# Altium schematic sheet ArduinoZeroV4.0_2.SchDoc: ArduinoZeroV4.0
size 409 x 289 mm; Origin: Eagle; Date: 2023-03-06 22:00:55; SheetNumber: 3; CODE-ARDUINO: DNP; DATASHEET: DNP; DISTRIBUTOR-LINK: DNP; DISTRIBUTOR-PN: DNP; MANUFACTURER: DNP; MANUFACTURER-PN: DNP; NOTE: DNP; Value: DNP; GateName_1: G$1; SymbolName_1: A3L-LOC; LibraryName: Arduino-utility; DeviceSetName: A3-FRAME; Sheet: Sheet:; ReferenceDesignsAREPROVIDED"ASIS"AND"WITHALLFAULTS.ArduinoSADISCLAIMSALLOTHERWARRANTIES,EXPRESSORIMPLIED,
REGARDINGPRODUCTS,INCLUDINGBUTNOTLIMITEDTO,ANYIMPLIEDWARRANTIESOFMERCHANTABILITYORFITNESSFORAPARTICULARPURPOSE

ArduinoSAmaymakechangestospecificationsandproductdescriptionsatanytime,withoutnotice.TheCustomermustnot
relyontheabsenceorcharacteristicsofanyfeaturesorinstructionsmarked"reserved"or"undefined."ArduinoSAreserves
theseforfuturedefinitionandshallhavenoresponsibilitywhatsoeverforconflictsorincompatibilitiesarisingfromfuturechangestothem.
TheproductinformationontheWebSiteorMaterialsissubjecttochangewithoutnotice.Donotfinalizeadesignwiththisinfo

ARDUINOandotherArduinobrandsandlogosandTrademarksofArduinoSA.AllArduinoSATrademarkscannotbeusedwithoutowner'sformalpermission: Reference Designs ARE PROVIDED "AS IS" AND "WITH ALL FAULTS. Arduino SA DISCLAIMS ALL OTHER WARRANTIES, EXPRESS OR IMPLIED, / REGARDING PRODUCTS, INCLUDING BUT NOT LIMITED TO, ANY IMPLIED WARRANTIES OF MERCHANTABILITY OR FITNESS FOR A PARTICULAR PURPOSE / Arduino SA may make changes to specifications and product descriptions at any time, without notice. The Customer must not / rely on the absence or characteristics of any features or instructions marked "reserved" or "undefined." Arduino SA reserves / these for future definition and shall have no responsibility whatsoever for conflicts or incompatibilities arising from future changes to them. / The product information on the Web Site or Materials is subject to change without notice. Do not finalize a design with this info / ARDUINO and other Arduino brands and logos and Trademarks of Arduino SA. All Arduino SA Trademarks cannot be used without owner's formal permission
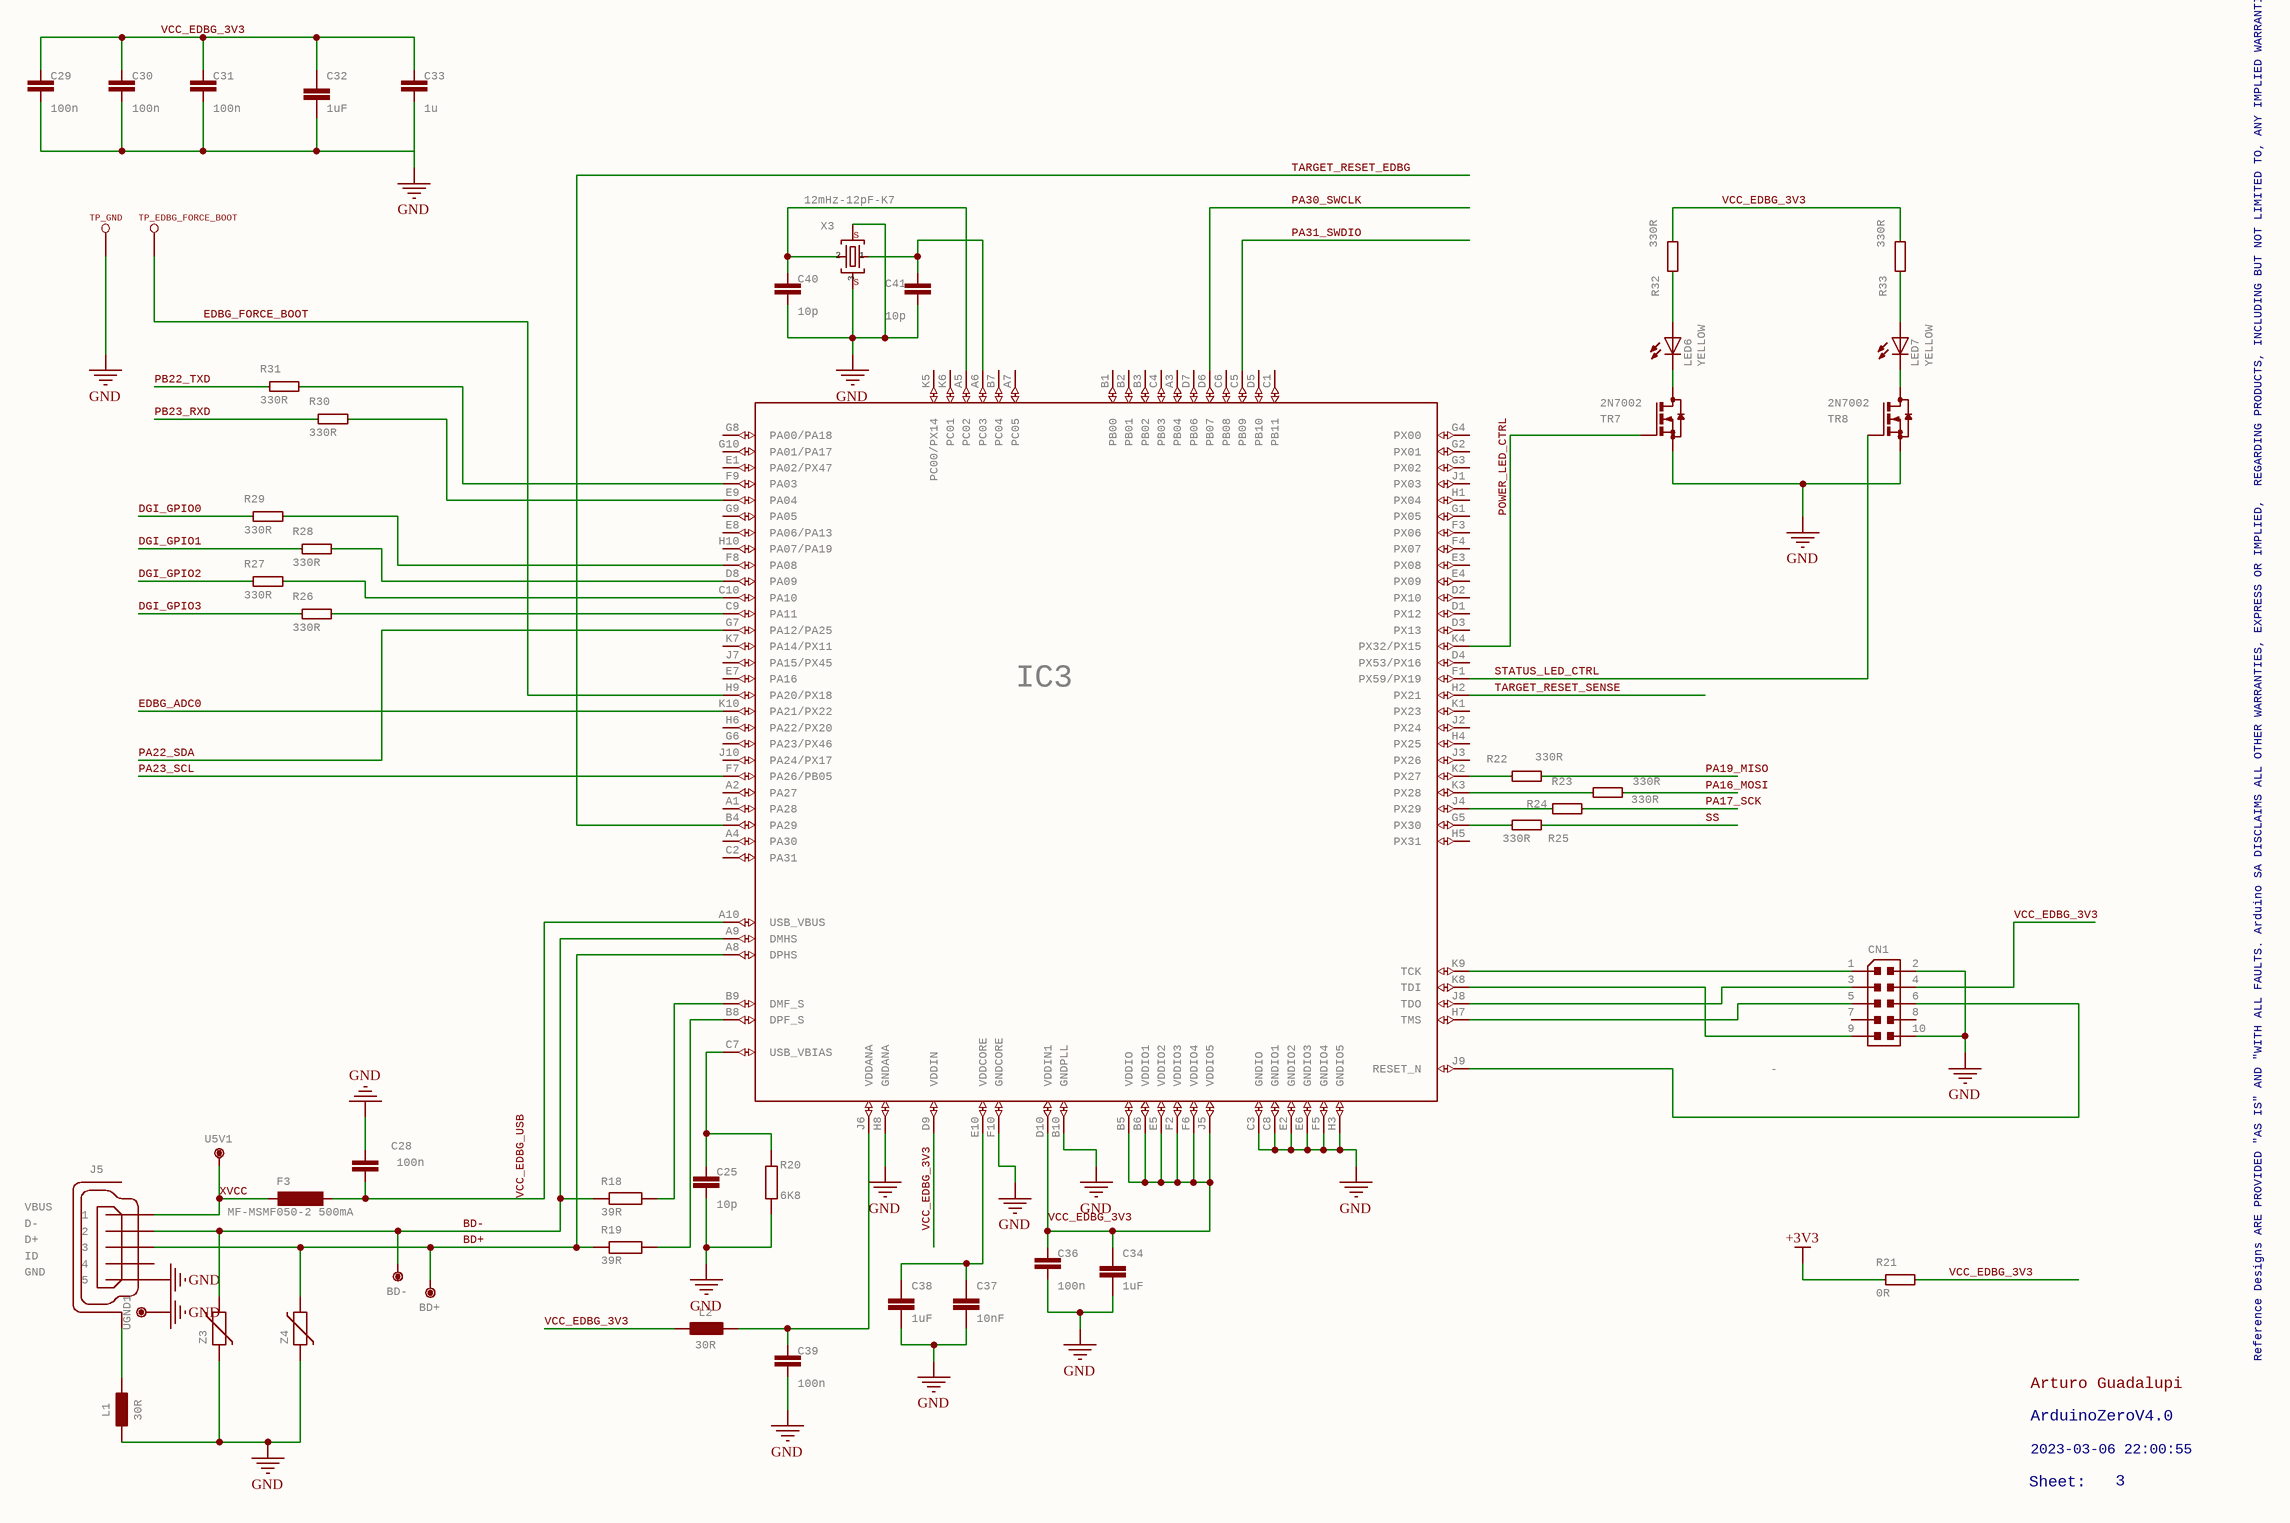
[diagram p0: ArduinoZeroV4.0_2.SchDoc]

## Parts
BD+  DNP  [TP-1.00MM]  (value not drawn)
BD-  DNP  [TP-1.00MM]  (value not drawn)
C25  10p  [0603-1608X90N]
C28  100n  [0603-1608X90N]
C29  100n  [0603-1608X90N]
C30  100n  [0603-1608X90N]
C31  100n  [0603-1608X90N]
C32  1uF  [C0603-ROUND]
C33  1u  [0603-1608X90N]
C34  1uF  [C0603-ROUND]
C36  100n  [0603-1608X90N]
C37  10nF  [C0603-ROUND]
C38  1uF  [C0603-ROUND]
C39  100n  [0603-1608X90N]
C40  10p  [0603-1608X90N]
C41  10p  [0603-1608X90N]
CN1  -  [PINHEAD_2X05_127]
F3  MF-MSMF050-2 500mA  [L1812]
IC3  1791_AT32UC3A4256HHB-C1UR  [VFBGA100]  (value not drawn)
J5  -  [ZX62-AB-5PA]  (value not drawn)
L1  30R  [0805-R2013X50N]
L2  30R  [0805-R2013X50N]
LED6  YELLOW  [CHIPLED_0805]
LED7  YELLOW  [CHIPLED_0805]
R18  39R  [R0603-ROUND]
R19  39R  [R0603-ROUND]
R20  6K8  [R0603-ROUND]
R21  0R  [C0603]
R22  330R  [C0603]
R23  330R  [C0603]
R24  330R  [C0603]
R25  330R  [C0603]
R26  330R  [C0603]
R27  330R  [C0603]
R28  330R  [C0603]
R29  330R  [C0603]
R30  330R  [C0603]
R31  330R  [C0603]
R32  330R  [C0603]
R33  330R  [C0603]
TP_EDBG_FORCE_BOOT  TP_SP  [TP-SP]  (value not drawn)
TP_GND  TP_SP  [TP-SP]  (value not drawn)
TR7  2N7002  [SOT23]
TR8  2N7002  [SOT23]
U5V1  DNP  [TP-1.00MM]  (value not drawn)
UGND1  DNP  [TP-1.00MM]  (value not drawn)
X3  12mHz-12pF-K7  [CRYSTAL-3.2-2.5]
Z3  -  [C0603]  (value not drawn)
Z4  -  [C0603]  (value not drawn)

## Nets
+3V3: R21.1
GND: C25.2 C28.2 C29.2 C30.2 C31.2 C32.2 C33.2 C34.2 C36.2 C37.2 C38.2 C39.2 C40.2 C41.2 CN1.2 CN1.10 IC3.B10(GNDPLL) IC3.C3(GNDIO) IC3.C8(GNDIO1) IC3.E2(GNDIO2) IC3.E6(GNDIO3) IC3.F5(GNDIO4) IC3.F10(GNDCORE) IC3.H3(GNDIO5) IC3.H8(GNDANA) J5.5 L1.1 R20.1 TP_GND.X(TESTP) TR7.2(S) TR8.2(S) UGND1.X(P$1) X3.2(GND) X3.4(GND) Z3.1 Z4.1
BD+: BD+.X(P$1) IC3.A8(DPHS) J5.3 R19.1 Z4.2
BD-: BD-.X(P$1) IC3.A9(DMHS) J5.2 R18.1 Z3.2
DGI_GPIO0: R29.1
DGI_GPIO1: R28.1
DGI_GPIO2: R27.1
DGI_GPIO3: R26.1
EDBG_ADC0: IC3.K10(PA21/PX22)
EDBG_FORCE_BOOT: IC3.H9(PA20/PX18) TP_EDBG_FORCE_BOOT.X(TESTP)
PA16_MOSI: R23.2
PA17_SCK: R24.2
PA19_MISO: R22.2
PA22_SDA: IC3.G7(PA12/PA25)
PA23_SCL: IC3.F7(PA26/PB05)
PA30_SWCLK: IC3.D6(PB07)
PA31_SWDIO: IC3.C5(PB09)
PB22_TXD: R31.1
PB23_RXD: R30.1
POWER_LED_CTRL: IC3.K4(PX32/PX15) TR7.1(G)
SS: R25.2
STATUS_LED_CTRL: IC3.F1(PX59/PX19) TR8.1(G)
TARGET_RESET_EDBG: IC3.B4(PA29)
TARGET_RESET_SENSE: IC3.H2(PX21)
VCC_EDBG_3V3: C29.1 C30.1 C31.1 C32.1 C33.1 C34.1 C36.1 CN1.4 IC3.B5(VDDIO) IC3.B6(VDDIO1) IC3.D9(VDDIN) IC3.D10(VDDIN1) IC3.E5(VDDIO2) IC3.F2(VDDIO3) IC3.F6(VDDIO4) IC3.J5(VDDIO5) L2.1 R21.2 R32.2 R33.2
VCC_EDBG_USB: C28.1 F3.1 IC3.A10(USB_VBUS)
XVCC: F3.2 J5.1 U5V1.X(P$1)
NetC25_1: C25.1 IC3.C7(USB_VBIAS) R20.2
NetC37_1: C37.1 C38.1 IC3.E10(VDDCORE)
NetC39_1: C39.1 IC3.J6(VDDANA) L2.2
NetC40_1: C40.1 IC3.A5(PC02) X3.3(C2)
NetC41_1: C41.1 IC3.A6(PC03) X3.1(C1)
NetCN1_1: CN1.1 IC3.K9(TCK)
NetCN1_3: CN1.3 IC3.J8(TDO)
NetCN1_5: CN1.5 IC3.H7(TMS)
NetCN1_6: CN1.6 IC3.J9(RESET_N)
NetCN1_9: CN1.9 IC3.K8(TDI)
NetIC3_B8: IC3.B8(DPF_S) R19.2
NetIC3_B9: IC3.B9(DMF_S) R18.2
NetIC3_C9: IC3.C9(PA11) R26.2
NetIC3_C10: IC3.C10(PA10) R27.2
NetIC3_D8: IC3.D8(PA09) R28.2
NetIC3_E9: IC3.E9(PA04) R30.2
NetIC3_F8: IC3.F8(PA08) R29.2
NetIC3_F9: IC3.F9(PA03) R31.2
NetIC3_G5: IC3.G5(PX30) R25.1
NetIC3_J4: IC3.J4(PX29) R24.1
NetIC3_K2: IC3.K2(PX27) R22.1
NetIC3_K3: IC3.K3(PX28) R23.1
NetJ5_6-11: J5.6-11(SH) L1.2
NetLED6_A: LED6.A R32.1
NetLED6_C: LED6.C TR7.3(D)
NetLED7_A: LED7.A R33.1
NetLED7_C: LED7.C TR8.3(D)

Not connected (* = marked no-connect by the designer): CN1 7 8; IC3 A1(PA28) A2(PA27) A3(PB04) A4(PA30) A7(PC05) B1(PB00) B2(PB01) B3(PB02) B7(PC04) C1(PB11) C2(PA31) C4(PB03) C6(PB08) D1(PX12) D2(PX10) D3(PX13) D4(PX53/PX16) D5(PB10) D7(PB06) E1(PA02/PX47) E3(PX08) E4(PX09) E7(PA16) E8(PA06/PA13) F3(PX06) F4(PX07) G1(PX05) G2(PX01) G3(PX02) G4(PX00) G6(PA23/PX46) G8(PA00/PA18) G9(PA05) G10(PA01/PA17) H1(PX04) H4(PX25) H5(PX31) H6(PA22/PX20) H10(PA07/PA19) J1(PX03) J2(PX24) J3(PX26) J7(PA15/PX45) J10(PA24/PX17) K1(PX23) K5(PC00/PX14) K6(PC01) K7(PA14/PX11); J5 4

## Notes on the sheet
- Reference Designs ARE PROVIDED "AS IS" AND "WITH ALL FAULTS. Arduino SA DISCLAIMS ALL OTHER WARRANTIES, EXPRESS OR IMPLIED,
  REGARDING PRODUCTS, INCLUDING BUT NOT LIMITED TO, ANY IMPLIED WARRANTIES OF MERCHANTABILITY OR FITNESS FOR A PARTICULAR PURPOSE
  Arduino SA may make changes to specifications and product descriptions at any time, without notice. The Customer must not
  rely on the absence or characteristics of any features or instructions marked "reserved" or "undefined." Arduino SA reserves
  these for future definition and shall have no responsibility whatsoever for conflicts or incompatibilities arising from future changes to them.
  The product information on the Web Site or Materials is subject to change without notice. Do not finalize a design with this info
  ARDUINO and other Arduino brands and logos and Trademarks of Arduino SA. All Arduino SA Trademarks cannot be used without owner's formal permission
- Arturo Guadalupi
- ArduinoZeroV4.0
- Sheet:
- 2023-03-06 22:00:55
- 3

## Library data of the parts
BD+ BD- U5V1 UGND1 = TPTP-1.00MM: Testpoint; GateName_1: G$1; DeviceSetName: TP; SymbolName_1: TESTPOINT; DeviceName: TP-1.00MM; LibraryName: Arduino-utility; CODE-ARDUINO: DNP; DATASHEET: DNP; DISTRIBUTOR-LINK: DNP; DISTRIBUTOR-PN: DNP; MANUFACTURER: DNP; MANUFACTURER-PN: DNP
C25 C40 C41 = C-0603: SMD Capacitor; GateName_1: G$1; SymbolName_1: C; DeviceName: -0603; CODE-ARDUINO: A5144; LibraryName: Arduino-rcl; DeviceSetName: C; DATASHEET: -; DISTRIBUTOR-LINK: -; DISTRIBUTOR-PN: -; MANUFACTURER: -; MANUFACTURER-PN: -; NOTE: -; PN-ALTERNATIVE1: PN-ALTERNATIVE1; PN-ALTERNATIVE2: PN-ALTERNATIVE2; PN-ALTERNATIVE3: PN-ALTERNATIVE3; PN-ALTERNATIVE4: PN-ALTERNATIVE4; PN-ALTERNATIVE5: PN-ALTERNATIVE5
C28-C31 C36 C39 = C-0603: SMD Capacitor; MANUFACTURER: Murata; MANUFACTURER-PN: GRM188R71C104KA01D; GateName_1: G$1; SymbolName_1: C; DeviceName: -0603; CODE-ARDUINO: 0015; PN-ALTERNATIVE1: NMC0603Y5V104Z25TRPF; PN-ALTERNATIVE2: C1608F104Z500NT; PN-ALTERNATIVE3: C0603C104K3RAC7411; PN-ALTERNATIVE4: 06035D104KAT2A; PN-ALTERNATIVE5: 0603B104K500CT; LibraryName: Arduino-rcl; DeviceSetName: C; DATASHEET: http://search.murata.co.jp/Ceramy/image/img/A01X/G101/ENG/GRM188R71C104KA01-01.pdf; DISTRIBUTOR-LINK: https://www.digikey.com/product-detail/en/murata-electronics-north-america/GRM188R71C104KA01D/490-1532-1-ND/587771; DISTRIBUTOR-PN: 490-1532-2-ND; NOTE: -
C32 C34 C38 = 0006_1UF_0603/GRM188R61E105KA12D: 1uF 0603; GateName_1: G$1; SymbolName_1: C-EU; MONTHLY_USAGE: _____; TYPE: Condensatori; LibraryName: Condensatori; DeviceSetName: 0006_1UF_0603/GRM188R61E105KA12D; CASE: 0603; PART_NUMBER: 1uF_0603/GRM188R61E105KA12D; PRICE: _____; SUPPLIER: _____
C33 = C-0603: SMD Capacitor; MANUFACTURER: Samsung; MANUFACTURER-PN: CL10B105KP8NNNC; GateName_1: G$1; SymbolName_1: C; DeviceName: -0603; CODE-ARDUINO: 0006; PN-ALTERNATIVE1: 0603X105K250CT; LibraryName: Arduino-rcl; DeviceSetName: C; DATASHEET: http://www.samsungsem.com/kr/support/product-search/mlcc/__icsFiles/afieldfile/2016/08/18/S_CL10B105KP8NNNC.pdf; DISTRIBUTOR-LINK: https://www.digikey.com/product-detail/en/samsung-electro-mechanics-america-inc/CL10B105KP8NNNC/1276-1946-1-ND/3890032; DISTRIBUTOR-PN: 1276-1946-1-ND; NOTE: -; PN-ALTERNATIVE2: PN-ALTERNATIVE2; PN-ALTERNATIVE3: PN-ALTERNATIVE3; PN-ALTERNATIVE4: PN-ALTERNATIVE4; PN-ALTERNATIVE5: PN-ALTERNATIVE5
C37 = 0408_1NF_0603: 1nF 0603; GateName_1: G$1; SymbolName_1: C-EU; MONTHLY_USAGE: _____; TYPE: Condensatori; LibraryName: Condensatori; DeviceSetName: 0408_1NF_0603; CASE: 0603; PART_NUMBER: 1nF_0603; PRICE: _____; SUPPLIER: _____
CN1 = JTAG_CONNECTOR-ROUND: 2x5 PASSO 1,27; GateName_1: G$1; DeviceName: -ROUND; CODE-ARDUINO: 0171; SymbolName_1: PINHEAD_2X05_127; LibraryName: Arduino-connectors; DeviceSetName: JTAG_CONNECTOR; DATASHEET: -; DISTRIBUTOR-LINK: -; DISTRIBUTOR-PN: -; MANUFACTURER: -; MANUFACTURER-PN: -
F3 = 0002_MF-MSMF050-2: 500 mA Multifuse ï¿½ Polyfuse; GateName_1: G$1; SymbolName_1: L-EU; MONTHLY_USAGE: _____; TYPE: Protezione; LibraryName: Protezione; DeviceSetName: 0002_MF-MSMF050-2; CASE: CASE; PART_NUMBER: MF-MSMF050-2; PRICE: _____; SUPPLIER: _____
IC3 = 1791_AT32UC3A4256HHB-C1UR: ATMEL  32-bit AVR  Microcontroller - VFBGA100; GateName_1: G$1; SymbolName_1: AT32UC3A; LibraryName: IntegratedCircuits; DeviceSetName: 1791_AT32UC3A4256HHB-C1UR
J5 = USB-MICRO: USB - micro AB USB 2.0 Receptacle Connector 5 Position Surface Mount, Right Angle, Horizontal; MANUFACTURER: Hirose; MANUFACTURER-PN: ZX62-AB-5PA(31); GateName_1: G$1; CODE-ARDUINO: 2219; SymbolName_1: USB-MICRO; LibraryName: Arduino-connectors; DeviceSetName: USB-MICRO; VBUS: VBUS; D-: D-; D+: D+; ID: ID; GND: GND; DATASHEET: https://www.hirose.com/product/en/download_file/key_name/ZX/category/Catalog/doc_file_id/31704/?file_category_id=4&item_id=13&is_series=1; DISTRIBUTOR-LINK: http://www.digikey.com/product-detail/en/hirose-electric-co-ltd/ZX62-AB-5PA(31)/H125279CT-ND/5994741; DISTRIBUTOR-PN: H125279CT-ND
L1 L2 = FERRITE0805: SMD ferrite; MANUFACTURER: Murata; MANUFACTURER-PN: BLM21PG300SN1D; GateName_1: >NAME; DeviceName: 0805; CODE-ARDUINO: 0001; PN-ALTERNATIVE1: MH2029-300Y; SymbolName_1: FERRITE; LibraryName: Arduino-rcl; DeviceSetName: FERRITE; DATASHEET: https://www.murata.com/en-us/products/productdata/8796738977822/ENFA0005.pdf; DISTRIBUTOR-LINK: https://www.digikey.it/product-detail/en/murata-electronics-north-america/BLM21PG300SN1D/490-1052-1-ND/584499; DISTRIBUTOR-PN: 490-1052-1-ND
LED6 LED7 = LED-0805: LED; MANUFACTURER: Lite-On; MANUFACTURER-PN: LTST-C170YKT; GateName_1: G$1; DeviceName: -0805; CODE-ARDUINO: 0044; PN-ALTERNATIVE1: KPT-2012YC; SymbolName_1: LED; LibraryName: Arduino-diodes; DeviceSetName: LED; DATASHEET: https://media.digikey.com/pdf/Data%20Sheets/Lite-On%20PDFs/LTST-C170GKT.pdf; DISTRIBUTOR-LINK: https://www.digikey.com/product-detail/it/lite-on-inc/LTST-C170YKT/160-1175-1-ND/269247; DISTRIBUTOR-PN: 160-1175-1-ND
R18 R19 = 0176_39_R_0603: 39R 0603; GateName_1: G$1; SymbolName_1: R-EU; MONTHLY_USAGE: _____; LibraryName: Resistenze; DeviceSetName: 0176_39_R_0603; CASE: 0603; PART_NUMBER: 39_R_0603; PRICE: _____; SUPPLIER: _____; TYPE: Resistenze
R20 = 0164_6K8_0603: 6K8 0603; GateName_1: G$1; SymbolName_1: R-EU; MONTHLY_USAGE: _____; LibraryName: Resistenze; DeviceSetName: 0164_6K8_0603; CASE: 0603; PART_NUMBER: 6K8_0603; PRICE: _____; SUPPLIER: _____; TYPE: Resistenze
R21 = R-0603: SMD Resistor; MANUFACTURER: Yageo; MANUFACTURER-PN: RC0603JR-070RL; GateName_1: G$1; SymbolName_1: R; DeviceName: -0603; CODE-ARDUINO: 0233; NOTE: NO; LibraryName: Arduino-rcl; DeviceSetName: R; DATASHEET: http://www.yageo.com/exep/pages/download/literatures/PYu-R_Marking_2.pdf; DISTRIBUTOR-LINK: https://www.digikey.com/product-detail/en/yageo/RC0603JR-070RL/311-0.0GRCT-ND/729622; DISTRIBUTOR-PN: 311-0.0GRCT-ND; PN-ALTERNATIVE1: -
R22-R33 = R-0603: SMD Resistor; MANUFACTURER: Yageo; MANUFACTURER-PN: RC0603FR-07330RL; GateName_1: G$1; SymbolName_1: R; DeviceName: -0603; CODE-ARDUINO: 0049; NOTE: NO; LibraryName: Arduino-rcl; DeviceSetName: R; DATASHEET: http://www.yageo.com/documents/recent/PYu-RC_Group_51_RoHS_L_10.pdf; DISTRIBUTOR-LINK: https://www.digikey.com/product-detail/en/yageo/RC0603FR-07330RL/311-330HRCT-ND/730109; DISTRIBUTOR-PN: 311-330HRCT-ND; PN-ALTERNATIVE1: -
TP_EDBG_FORCE_BOOT TP_GND = TP_SP: GateName_1: G$1; SymbolName_1: TP-SP; LibraryName: SmartPrj; DeviceSetName: TP_SP
TR7 TR8 = 2N7002T-SOT23: MOSFET N-CH 60V 115MA; MANUFACTURER: Micro Commercial Co; MANUFACTURER-PN: 2N7002-TP; GateName_1: G$1; SymbolName_1: N-MOS-1; DeviceName: -SOT23; CODE-ARDUINO: 1612; LibraryName: Arduino-transistors; DeviceSetName: 2N7002T; DATASHEET: http://www.mccsemi.com/up_pdf/2N7002(SOT-23).PDF; DISTRIBUTOR-LINK: https://www.digikey.com/product-detail/it/micro-commercial-co/2N7002-TP/2N7002-TPMSCT-ND/1960099; DISTRIBUTOR-PN: 2N7002-TPMSCT-ND
X3 = 0396_12MHZ-12PF-K7: 12Mhz - K7    12pF - SMD; GateName_1: G$1; SymbolName_1: CRYSTAL-KX7; LibraryName: Cristalli; DeviceSetName: 0396_12MHZ-12PF-K7; 1: 1; 2: 2; 3: 3; S: S
Z3 Z4 = VARISTOR: Varistors; MANUFACTURER: Bourns; GateName_1: A; CODE-ARDUINO: 0010; CODE-TK2: CG0603MLC-05E; NOTE: NO; SymbolName_1: VARISTOR; LibraryName: Arduino-rcl; DeviceSetName: VARISTOR; DATASHEET: http://www.bourns.com/data/global/pdfs/MLC.pdf; DISTRIBUTOR-LINK: https://www.digikey.com/product-detail/it/bourns-inc/CG0603MLC-05E/CG0603MLC-05ECT-ND/3438061; DISTRIBUTOR-PN: CG0603MLC-05ETR-ND; MANUFACTURER-PN: CG0603MLC-05E